# Altium schematic sheet MCU_EGT.SchDoc
size A
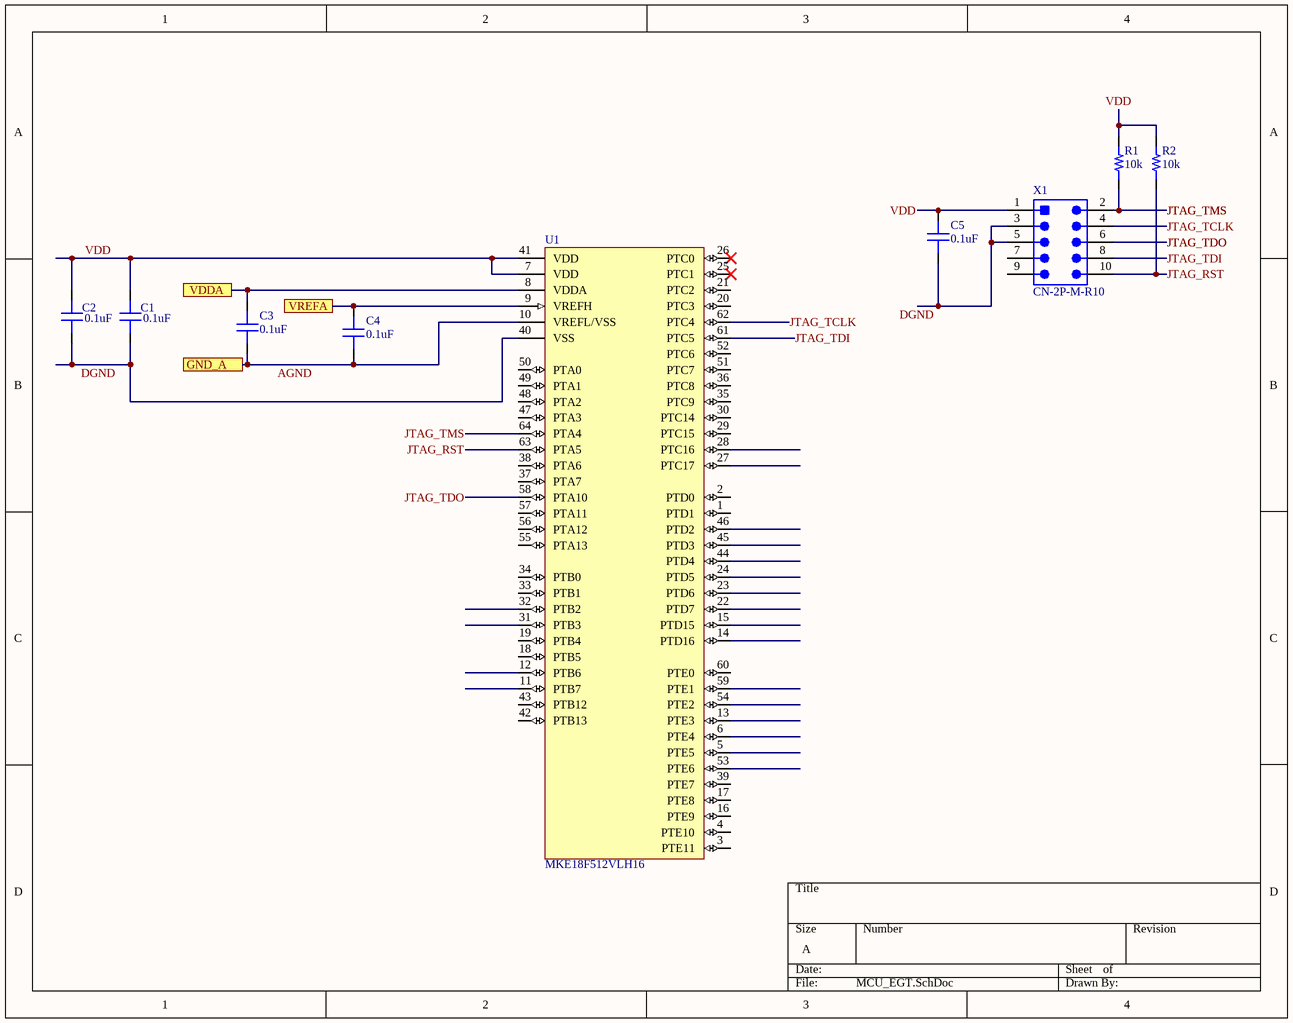
[diagram p0: MCU_EGT.SchDoc]

## Parts
C1  capacitance: 0.1uF  [0603]  (hidden comment: capacitor)
C2  capacitance: 0.1uF  [0603]  (hidden comment: capacitor)
C3  capacitance: 0.1uF  [0603]  (hidden comment: capacitor)
C4  capacitance: 0.1uF  [0603]  (hidden comment: capacitor)
C5  capacitance: 0.1uF  [0603]  (hidden comment: capacitor)
R1  resistance: 10k  [0603]  (hidden comment: resistor)
R2  resistance: 10k  [0603]  (hidden comment: resistor)
U1  MKE18F512VLH16  [TQFP64]
X1  CN-2P-M-R10  [HDR2X5_SMT]

## Ports
GND_A, VDDA, VREFA

## Nets
AGND: C3.1 C4.1 U1.10(VREFL/VSS) ; port GND_A
DGND: C1.1 C2.1 C5.1 U1.40(VSS) X1.3 X1.5
JTAG_RST: R2.1 U1.63(PTA5) X1.10
JTAG_TCLK: U1.62(PTC4) X1.4
JTAG_TDI: U1.61(PTC5) X1.8
JTAG_TDO: U1.58(PTA10) X1.6
JTAG_TMS: R1.1 U1.64(PTA4) X1.2
VDD: C1.2 C2.2 C5.2 R1.2 R2.2 U1.7(VDD) U1.41(VDD) X1.1
VDDA: C3.2 U1.8(VDDA) ; port VDDA
VREFA: C4.2 U1.9(VREFH) ; port VREFA

Not connected (* = marked no-connect by the designer): U1 1(PTD1) 2(PTD0) 3(PTE11) 4(PTE10) 5(PTE5) 6(PTE4) 11(PTB7) 12(PTB6) 13(PTE3) 14(PTD16) 15(PTD15) 16(PTE9) 17(PTE8) 18(PTB5) 19(PTB4) 20(PTC3) 21(PTC2) 22(PTD7) 23(PTD6) 24(PTD5) 25(PTC1)* 26(PTC0)* 27(PTC17) 28(PTC16) 29(PTC15) 30(PTC14) 31(PTB3) 32(PTB2) 33(PTB1) 34(PTB0) 35(PTC9) 36(PTC8) 37(PTA7) 38(PTA6) 39(PTE7) 42(PTB13) 43(PTB12) 44(PTD4) 45(PTD3) 46(PTD2) 47(PTA3) 48(PTA2) 49(PTA1) 50(PTA0) 51(PTC7) 52(PTC6) 53(PTE6) 54(PTE2) 55(PTA13) 56(PTA12) 57(PTA11) 59(PTE1) 60(PTE0); X1 7 9

## Library data of the parts
C1-C5 = 1: Generic 0603 capacitor; id: 1; voltage: 50; dielectric: Ceramic; percent tolerance: 10; Name: 0603 Capacitor; ESR: 1; package: 0603; quantity: 0
R1 R2 = 1: id: 1; Name: 0603 Resistor; percent tolerance: 5; package: 0603; quantity: 0
U1 = 1: 32b NXP Microcontroller; id: 1; voltagemin: 2.70000004768372; voltagemax: 5.5; name: MKE18F512VLH16; package: TQFP64; quantity: 0
X1 = 4: CONN_TE_2X5POS; id: 4; Name: 5103309-1; numcontacts: 10; numrows: 2; pitch: 2.54mm; MfrPartNo: *; link: https://www.digikey.com/product-detail/en/5103309-1/A33160-ND/1114898?utm_campaign=buynow&WT.z_cid=ref_octopart_dkc_buynow&utm_medium=aggregator&curr=usd&site=us&utm_source=octopart; quantity: 0